# EAGLE design XibecaModuleTop (EAGLE 9.6.2)
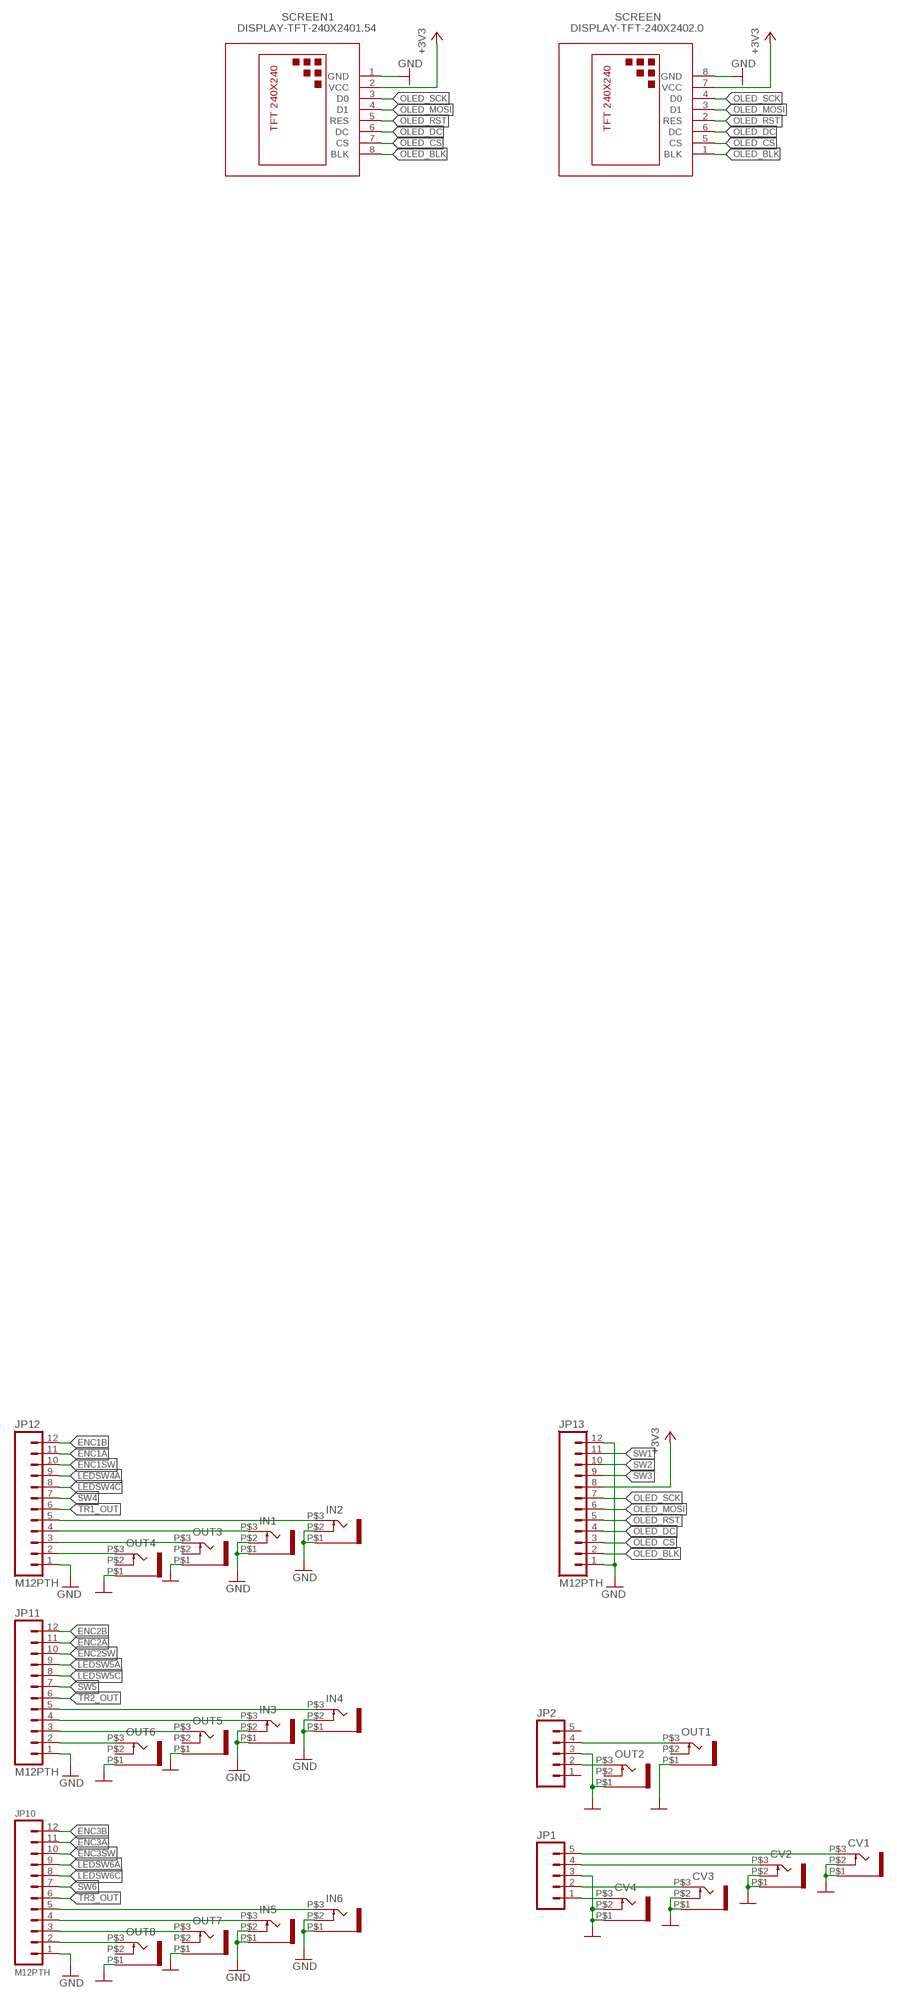
[diagram p0: schematic, sheet 1, part 1 of 2]
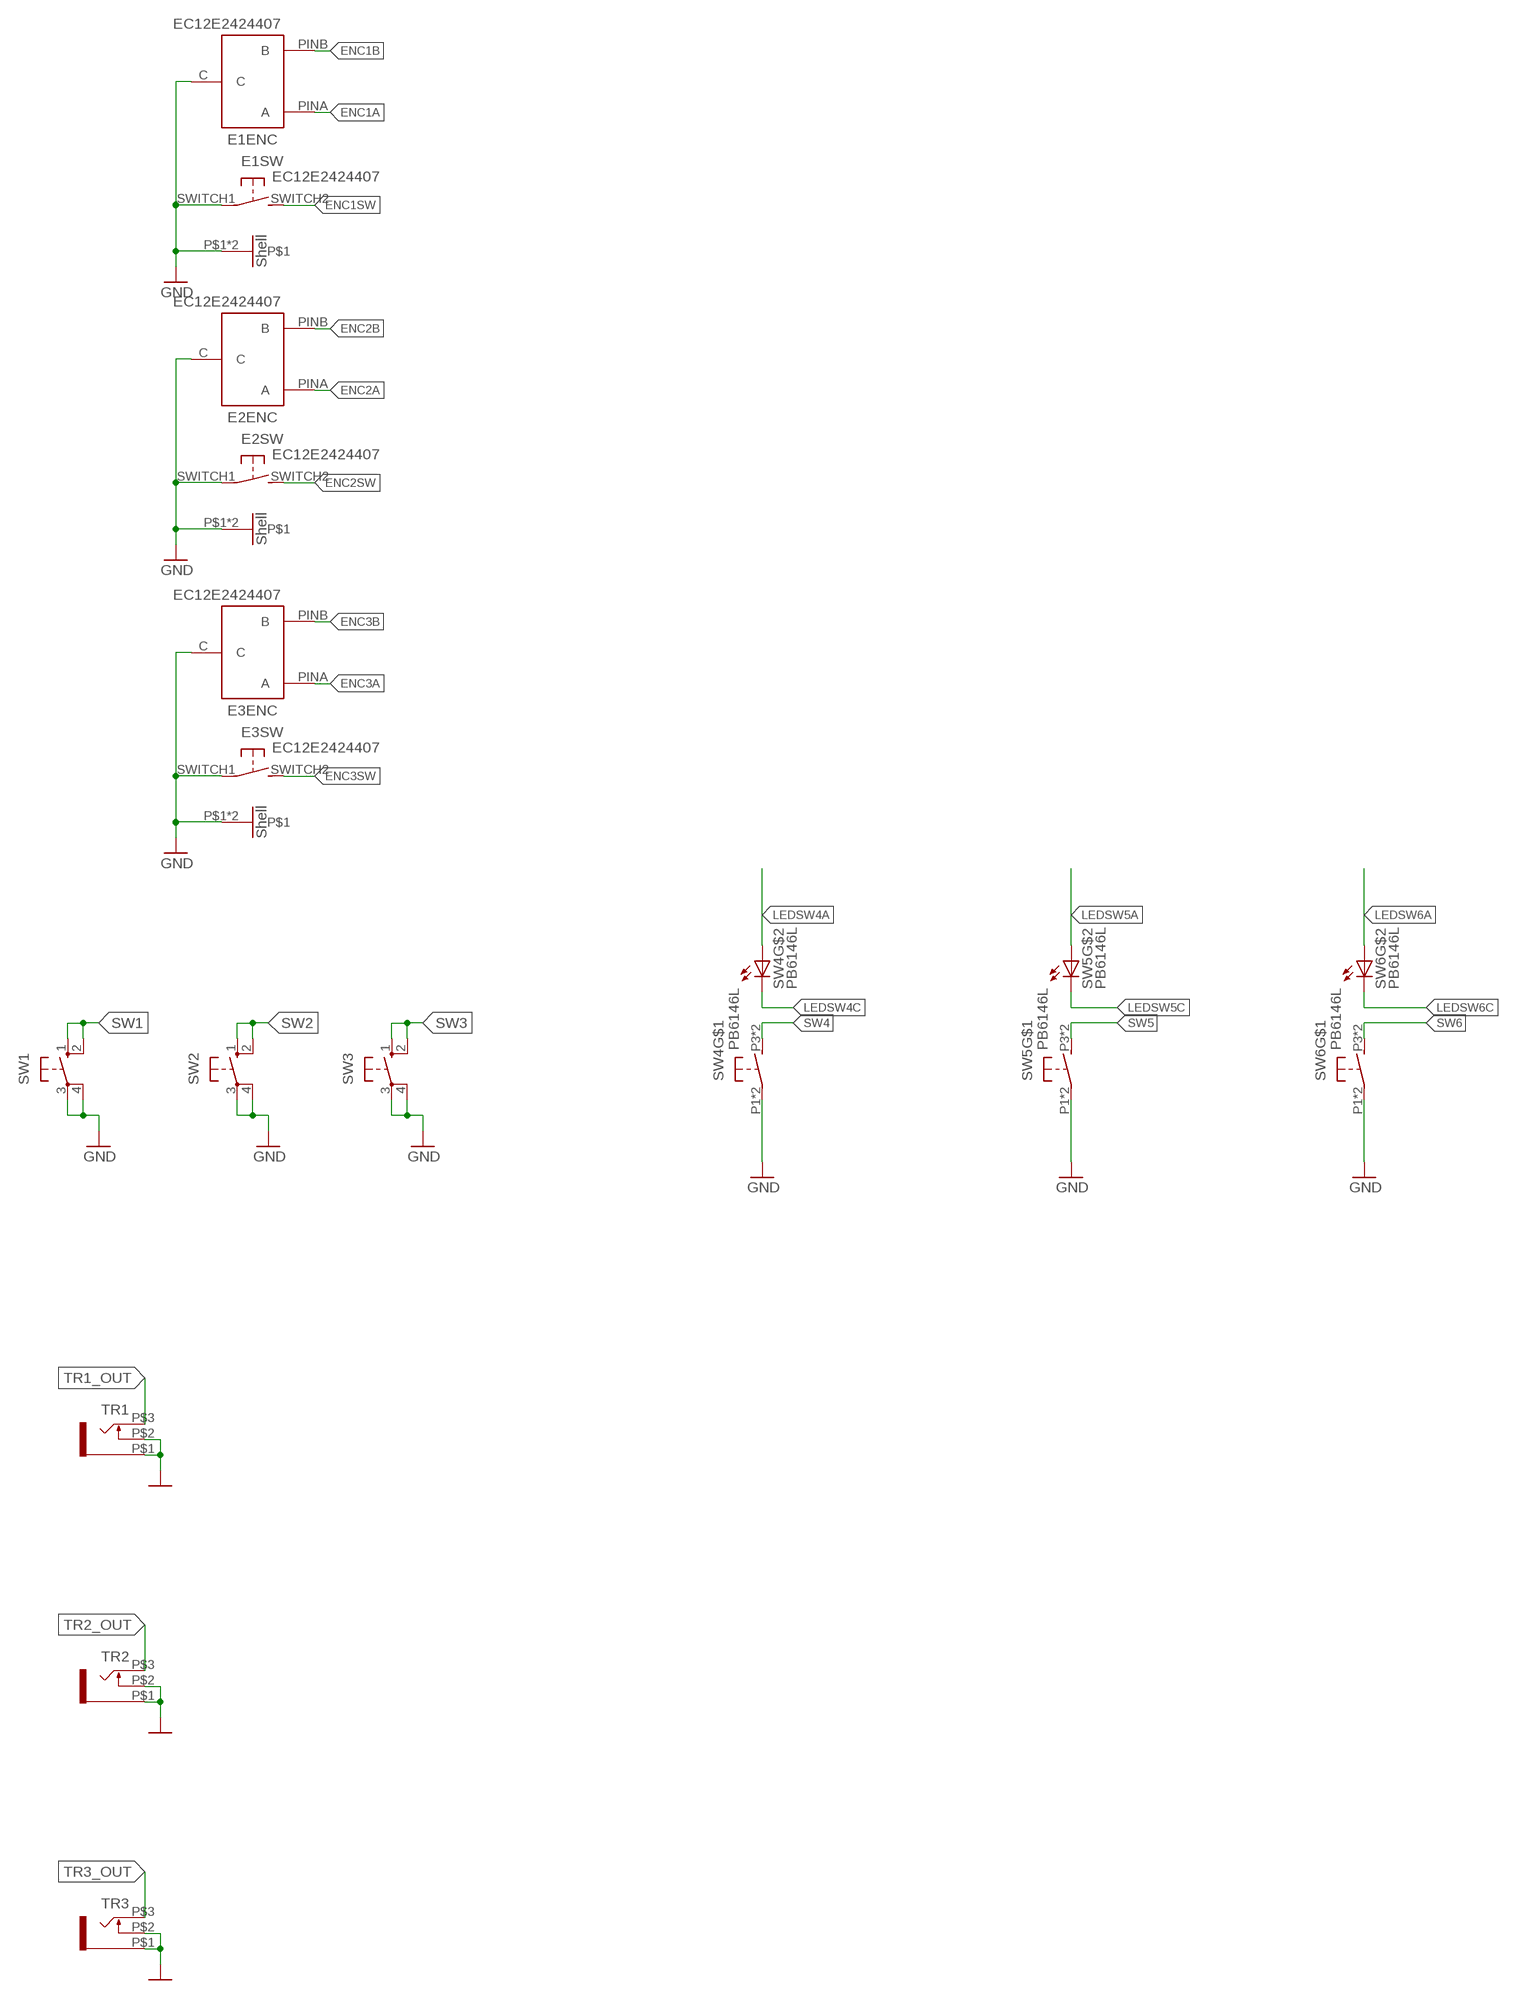
[diagram p1: schematic, sheet 1, part 2 of 2]

## Parts
CV1  THONKICONN  [THONKICONN]
CV2  THONKICONN  [THONKICONN]
CV3  THONKICONN  [THONKICONN]
CV4  THONKICONN  [THONKICONN]
E1  EC12E2424407  [EC12E2424407]
E2  EC12E2424407  [EC12E2424407]
E3  EC12E2424407  [EC12E2424407]
IN1  THONKICONN  [THONKICONN]
IN2  THONKICONN  [THONKICONN]
IN3  THONKICONN  [THONKICONN]
IN4  THONKICONN  [THONKICONN]
IN5  THONKICONN  [THONKICONN]
IN6  THONKICONN  [THONKICONN]
JP1  M05PTH  [1X05]
JP2  M05PTH  [1X05]
JP10  M12PTH  [1X12]
JP11  M12PTH  [1X12]
JP12  M12PTH  [1X12]
JP13  M12PTH  [1X12]
OUT1  THONKICONN  [THONKICONN]
OUT2  THONKICONN  [THONKICONN]
OUT3  THONKICONN  [THONKICONN]
OUT4  THONKICONN  [THONKICONN]
OUT5  THONKICONN  [THONKICONN]
OUT6  THONKICONN  [THONKICONN]
OUT7  THONKICONN  [THONKICONN]
OUT8  THONKICONN  [THONKICONN]
SCREEN  DISPLAY-TFT-240X2402.0  [DISPLAY-TFT-240X320-2.0"]
SCREEN1  DISPLAY-TFT-240X2401.54  [DISPLAY-TFT-240X240-1.54"]
SW1  10-XX  [B3F-10XX]
SW2  10-XX  [B3F-10XX]
SW3  10-XX  [B3F-10XX]
SW4  PB6146L  [PB6146L]
SW5  PB6146L  [PB6146L]
SW6  PB6146L  [PB6146L]
TR1  THONKICONN  [THONKICONN]
TR2  THONKICONN  [THONKICONN]
TR3  THONKICONN  [THONKICONN]

## Nets
+3V3: JP13.8 SCREEN1.2(VCC) SCREEN.7(VCC)
ENC1A: E1.PINA(ENC:A) JP12.11
ENC1B: E1.PINB(ENC:B) JP12.12
ENC1SW: E1.SWITCH2(SW:S) JP12.10
ENC2A: E2.PINA(ENC:A) JP11.11
ENC2B: E2.PINB(ENC:B) JP11.12
ENC2SW: E2.SWITCH2(SW:S) JP11.10
ENC3A: E3.PINA(ENC:A) JP10.11
ENC3B: E3.PINB(ENC:B) JP10.12
ENC3SW: E3.SWITCH2(SW:S) JP10.10
GND: CV1.P$1 CV1.P$2 CV2.P$1 CV2.P$2 CV3.P$1 CV3.P$2 CV4.P$1 CV4.P$2 E1.C(ENC:C) E1.P$1 E1.P$2 E1.SWITCH1(SW:P) E2.C(ENC:C) E2.P$1 E2.P$2 E2.SWITCH1(SW:P) E3.C(ENC:C) E3.P$1 E3.P$2 E3.SWITCH1(SW:P) IN1.P$1 IN1.P$2 IN2.P$1 IN2.P$2 IN3.P$1 IN3.P$2 IN4.P$1 IN4.P$2 IN5.P$1 IN5.P$2 IN6.P$1 IN6.P$2 JP1.3 JP2.3 JP10.1 JP11.1 JP12.1 JP13.1 JP13.12 OUT1.P$1 OUT2.P$1 OUT3.P$1 OUT4.P$1 OUT5.P$1 OUT6.P$1 OUT7.P$1 OUT8.P$1 SCREEN1.1(GND) SCREEN.8(GND) SW1.3(P) SW1.4(P1) SW2.3(P) SW2.4(P1) SW3.3(P) SW3.4(P1) SW4.P1(P) SW4.P2(P) SW5.P1(P) SW5.P2(P) SW6.P1(P) SW6.P2(P) TR1.P$1 TR1.P$2 TR2.P$1 TR2.P$2 TR3.P$1 TR3.P$2
LEDSW4A: JP12.9 SW4.PL1(A)
LEDSW4C: JP12.8 SW4.PL2(C)
LEDSW5A: JP11.9 SW5.PL1(A)
LEDSW5C: JP11.8 SW5.PL2(C)
LEDSW6A: JP10.9 SW6.PL1(A)
LEDSW6C: JP10.8 SW6.PL2(C)
N$19: IN2.P$3 JP12.5
N$33: IN1.P$3 JP12.4
N$34: JP12.3 OUT3.P$3
N$43: JP12.2 OUT4.P$3
N$46: JP11.2 OUT6.P$3
N$51: JP11.3 OUT5.P$3
N$54: JP2.4 OUT1.P$3
N$55: JP2.2 OUT2.P$3
N$58: IN3.P$3 JP11.4
N$62: IN4.P$3 JP11.5
N$67: JP10.2 OUT8.P$3
N$86: JP10.3 OUT7.P$3
N$87: IN5.P$3 JP10.4
N$88: IN6.P$3 JP10.5
N$89: CV4.P$3 JP1.1
N$90: CV1.P$3 JP1.5
N$91: CV2.P$3 JP1.4
N$92: CV3.P$3 JP1.2
OLED_BLK: JP13.2 SCREEN1.8(BLK) SCREEN.1(BLK)
OLED_CS: JP13.3 SCREEN1.7(CS) SCREEN.5(CS)
OLED_DC: JP13.4 SCREEN1.6(DC) SCREEN.6(DC)
OLED_MOSI: JP13.6 SCREEN1.4(D1) SCREEN.3(D1)
OLED_RST: JP13.5 SCREEN1.5(RES) SCREEN.2(RES)
OLED_SCK: JP13.7 SCREEN1.3(D0) SCREEN.4(D0)
SW1: JP13.11 SW1.1(S) SW1.2(S1)
SW2: JP13.10 SW2.1(S) SW2.2(S1)
SW3: JP13.9 SW3.1(S) SW3.2(S1)
SW4: JP12.7 SW4.P3(S) SW4.P4(S)
SW5: JP11.7 SW5.P3(S) SW5.P4(S)
SW6: JP10.7 SW6.P3(S) SW6.P4(S)
TR1_OUT: JP12.6 TR1.P$3
TR2_OUT: JP11.6 TR2.P$3
TR3_OUT: JP10.6 TR3.P$3
Unconnected: JP2.1 JP2.5 OUT1.P$2 OUT2.P$2 OUT3.P$2 OUT4.P$2 OUT5.P$2 OUT6.P$2 OUT7.P$2 OUT8.P$2

## Library data of the parts
CV1-CV4 IN1-IN6 OUT1-OUT8 TR1-TR3 = Rebel:THONKICONN
E1-E3 = Rebel:EC12E2424407: rotary encoder with switch EC12E2424407
JP1 JP2 = SparkFun:M05: Header 5 Standard 5-pin 0.1" header. Use with straight break away headers (SKU : PRT-00116), right angle break away headers (PRT-00553), swiss pins (PRT-00743), machine pins (PRT-00117), and female headers (PRT-00115). Molex polarized connector foot print use with SKU : PRT-08230 with associated crimp pins and housings.
JP10-JP13 = SparkFun:M12: Header 12 Standard 12-pin 0.1" header. Use with straight break away headers (SKU : PRT-00116), right angle break away headers (PRT-00553), swiss pins (PRT-00743), machine pins (PRT-00117), and female headers (PRT-00115).
SCREEN SCREEN1 = diy-modules:DISPLAY-TFT-240X240: 240X240 TFT Screen Module with ST7789 driver chip Variant with SPI interface
SW1-SW3 = switch-omron:10-XX: OMRON SWITCH; MPN: B3F-1000; OC_FARNELL: 176432; OC_NEWARK: 36M3542
SW4-SW6 = Rebel:PB6146L

## Net classes
1 power: width 0.178 mm, drill 0.305 mm, clearance 0.178 mm to class 0, clearance 0.178 mm

## Board
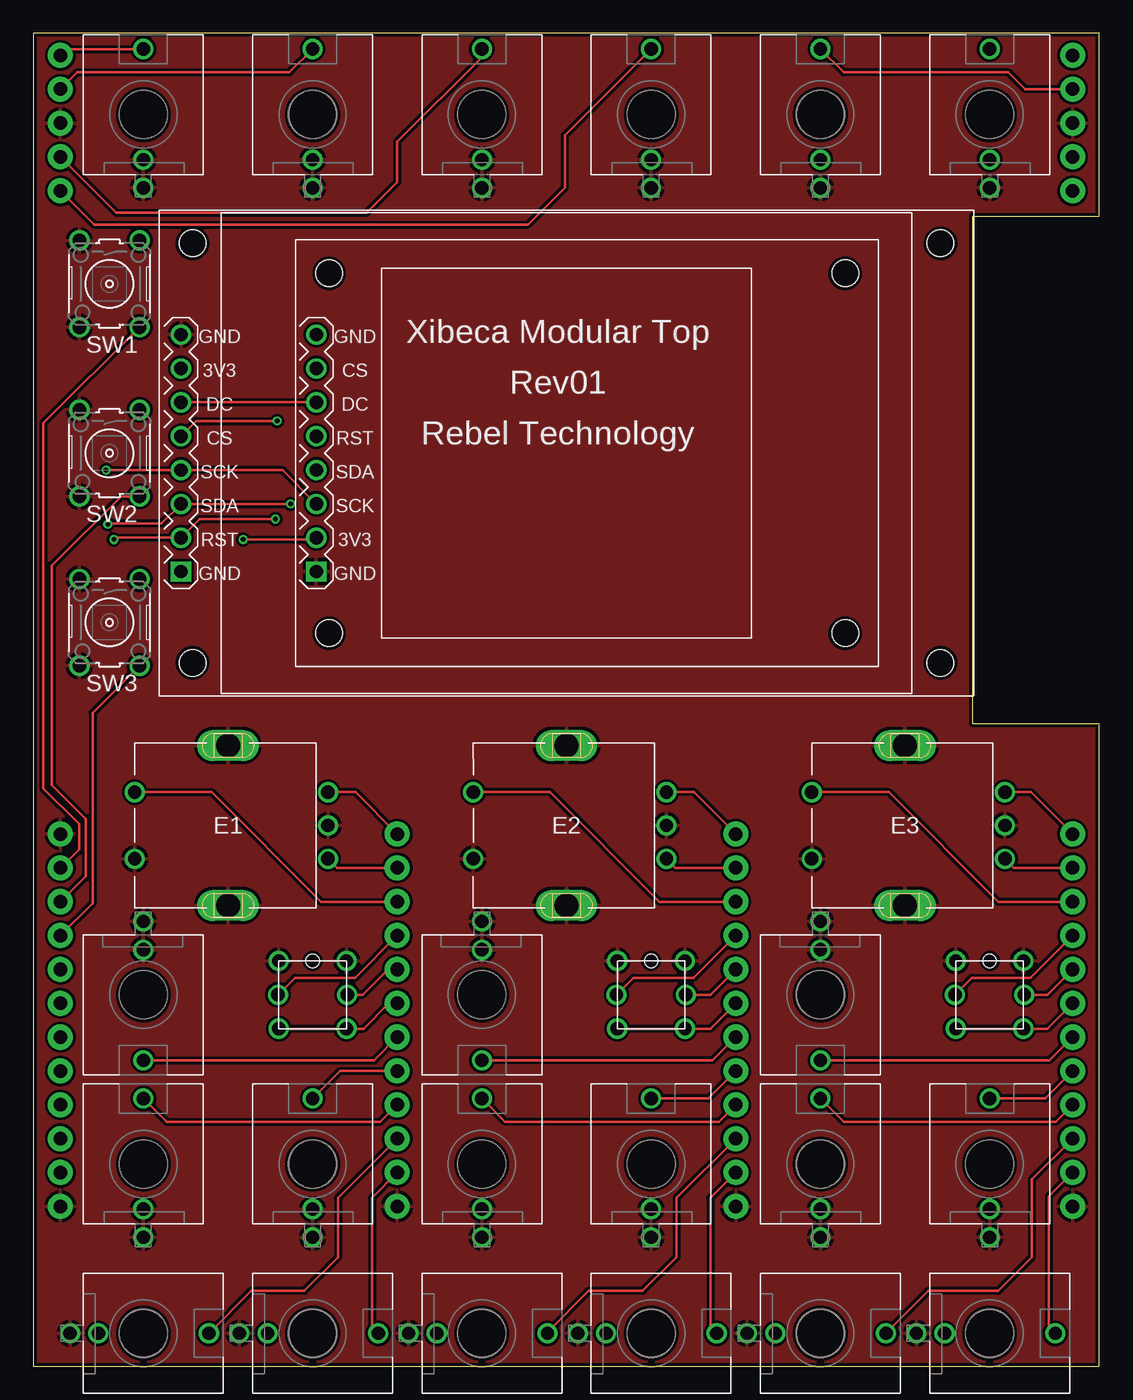
[diagram p2: board, top side]
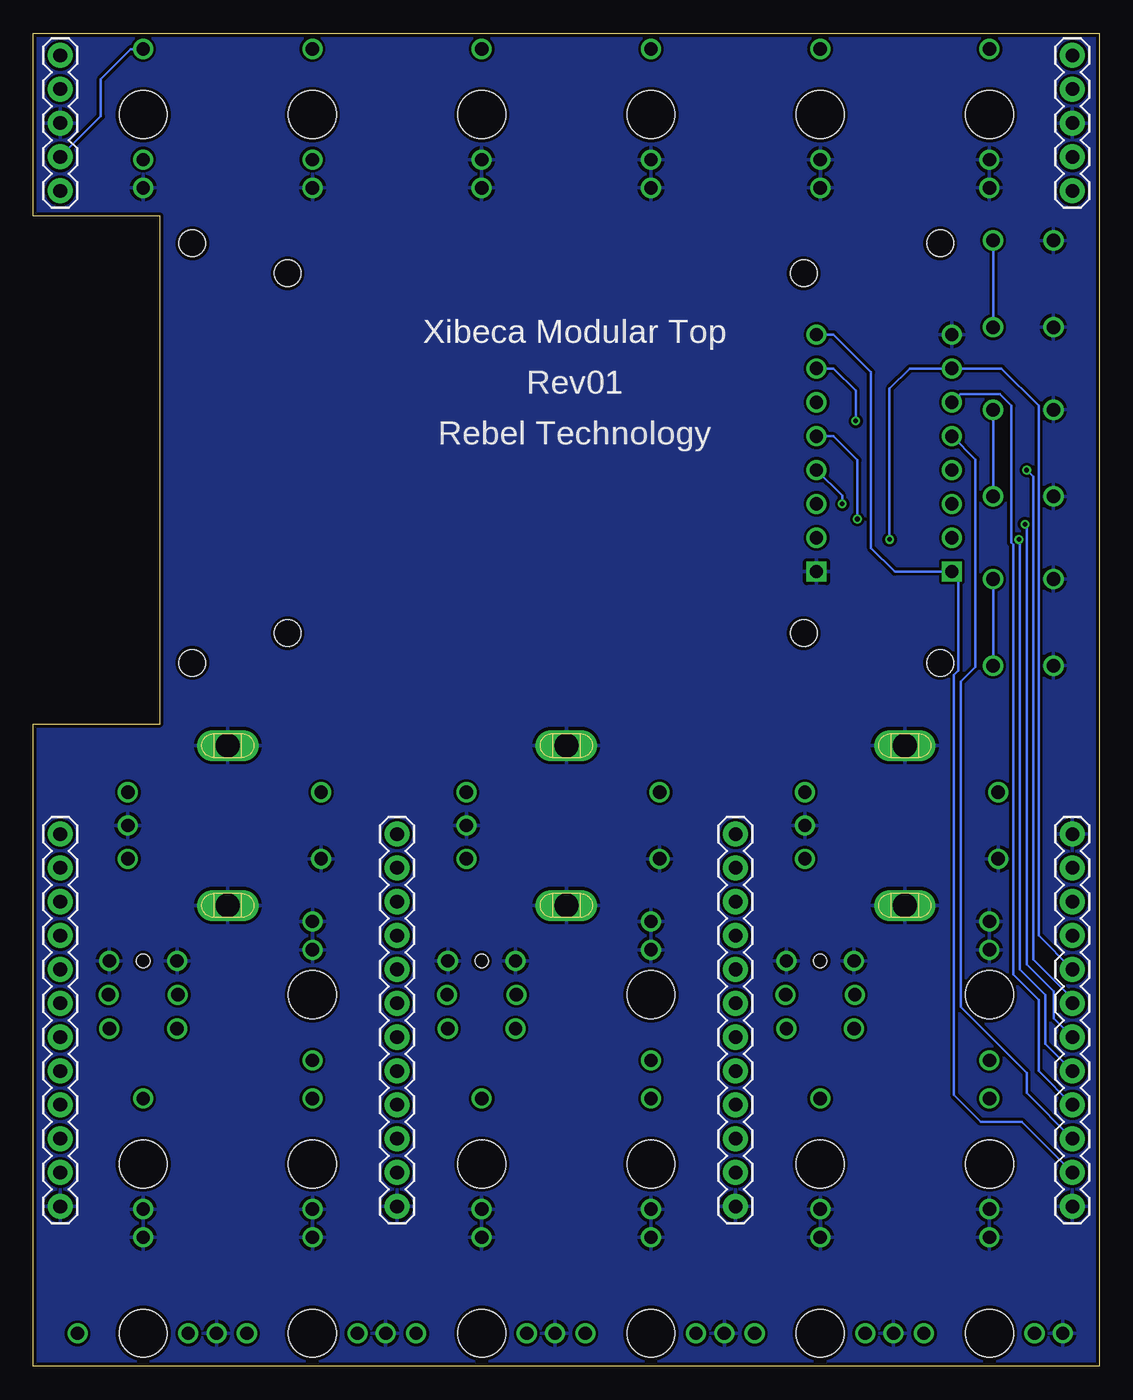
[diagram p3: board, bottom side, seen from below]

Size 80 x 100 mm. Coordinates in mm from the lower left corner, seen from the top.
Outline: 80,86.28 80,100 0,100 0,0 80,0 80,48.18 70.48,48.18 70.48,86.28 80,86.28
Copper layers (1*16): Top 0.035mm / dielectric 1.5mm / Bottom 0.035mm
Design rules "Fusion_eagle_rule_v1.1": minimum track width 6mil, minimum drill 12mil, track to track 6mil, track to pad 6mil, pad to pad 6mil, via to via 6mil, smd to smd 0mil, copper to edge 10mil, drill to drill 10mil, minimum pad ring 10mil, minimum via ring 6mil, stop-mask expansion 2mil, vias tented up to drill 100mil, thermal gap 10mil

### Footprints (pad centres in the part's own frame; a part is rotated, then mirrored left to right if it is on the bottom)
THONKICONN = drill 1: P$1 0,-5.5; P$2 0,-3.38; P$3 0,4.92 | hole 3.6: 0,0
EC12E2424407 = drill 1: C 0,-7.5; PINA -2.5,-7.5; PINB 2.5,-7.5; SWITCH1 -2.5,7; SWITCH2 2.5,7 | drill 1.8 long: P$1 -6,0; P$2 6,0
1X05 = drill 1.016 pad 1.88: 1 0,0; 2 2.54,0; 3 5.08,0; 4 7.62,0; 5 10.16,0
1X12 = drill 1.016 pad 1.88: 1 0,0; 2 2.54,0; 3 5.08,0; 4 7.62,0; 5 10.16,0; 6 12.7,0; 7 15.24,0; 8 17.78,0; 9 20.32,0; 10 22.86,0; 11 25.4,0; 12 27.94,0
DISPLAY-TFT-240X320-2.0" = drill 1 square: 1 -8.89,28.93 | drill 1: 2 -6.35,28.93; 3 -3.81,28.93; 4 -1.27,28.93; 5 1.27,28.93; 6 3.81,28.93; 7 6.35,28.93; 8 8.89,28.93 | hole 2: -15.74,28.06; 15.74,28.06; 15.74,-28.06; -15.74,-28.06
DISPLAY-TFT-240X240-1.54" = drill 1 square: 1 -8.89,18.77 | drill 1: 2 -6.35,18.77; 3 -3.81,18.77; 4 -1.27,18.77; 5 1.27,18.77; 6 3.81,18.77; 7 6.35,18.77; 8 8.89,18.77 | hole 2: -13.5,17.81; 13.5,17.81; 13.5,-20.91; -13.5,-20.91
B3F-10XX = drill 1.016: 1 -3.251,2.261; 2 3.251,2.261; 3 -3.251,-2.261; 4 3.251,-2.261
PB6146L = drill 1: P1 -2.54,2.54; P2 2.54,2.54; P3 -2.54,-2.54; P4 2.54,-2.54; PL1 -2.6,0; PL2 2.6,0 | hole 1: 0,2.54

### Placement (x,y rotation side)
CV1  8.26,93.9 0 top
CV2  20.95,93.9 0 top
CV3  33.66,93.9 0 top
CV4  46.35,93.9 0 top
E1  14.61,40.56 90 top
E2  40.01,40.56 90 top
E3  65.41,40.56 90 top
IN1  8.26,15.16 0 top
IN2  20.95,15.16 0 top
IN3  33.66,15.16 0 top
IN4  46.35,15.16 0 top
IN5  59.05,15.16 0 top
IN6  71.75,15.16 0 top
JP1  2.03,88.19 90 bottom
JP2  77.98,88.19 90 bottom
JP10  77.98,11.99 90 bottom
JP11  52.7,11.99 90 bottom
JP12  27.3,11.99 90 bottom
JP13  2.03,11.99 90 bottom
OUT1  59.05,93.9 0 top
OUT2  71.75,93.9 0 top
OUT3  8.26,2.46 270 top
OUT4  20.95,2.46 270 top
OUT5  33.66,2.46 270 top
OUT6  46.35,2.46 270 top
OUT7  59.05,2.46 270 top
OUT8  71.75,2.46 270 top
SCREEN  40.01,68.5 90 top
SCREEN1  40.01,68.5 90 top
SW1  5.71,81.2 270 top
SW2  5.71,68.5 270 top
SW3  5.71,55.8 270 top
SW4  20.95,27.86 0 top
SW5  46.35,27.86 0 top
SW6  71.75,27.86 0 top
TR1  8.26,27.86 180 top
TR2  33.66,27.86 180 top
TR3  59.05,27.86 180 top

### Tracks (layer width: path | path; a pad name or v marks a point on that pad's centre or on a via)
+3V3  (via drill 0.35)
  Top 0.203: v15.75,62.03 21.11,62.03 SCREEN1.2
  Bottom 0.203: JP13.8 4.57,32.31 4.57,72.06 7.37,74.85 SCREEN.7 14.22,74.85 15.75,73.33 v15.75,62.03
ENC1A
  Top 0.203: JP12.11 22.78,37.39 E1.PINA
ENC1B
  Top 0.203: JP12.12 24.17,43.06 E1.PINB
ENC1SW
  Top 0.203: E1.SWITCH2 13.38,43.06 21.59,34.85 JP12.10
ENC2A
  Top 0.203: JP11.11 48.18,37.39 E2.PINA
ENC2B
  Top 0.203: JP11.12 49.57,43.06 E2.PINB
ENC2SW
  Top 0.203: JP11.10 46.99,34.85 38.77,43.06 E2.SWITCH2
ENC3A
  Top 0.203: JP10.11 73.58,37.39 E3.PINA
ENC3B
  Top 0.203: E3.PINB 74.84,43.06 JP10.12
ENC3SW
  Top 0.203: JP10.10 72.39,34.85 64.17,43.06 E3.SWITCH2
GND
  pour Top (isolate 0.2): -2.24,116.76 85.65,116.76 85.65,-10.24 -2.24,-10.24
  pour Bottom (isolate 0.2): -7.92,111.68 83.34,111.68 83.34,-15.32 -7.92,-15.32
LEDSW4A
  Top 0.203: SW4.PL1 19.62,29.13 24.13,29.13 JP12.9
LEDSW4C
  Top 0.203: SW4.PL2 24.7,27.86 26.6,29.77 JP12.8
LEDSW5A
  Top 0.203: SW5.PL1 45.02,29.13 49.53,29.13 JP11.9
LEDSW5C
  Top 0.203: JP11.8 50.8,27.86 SW5.PL2
LEDSW6A
  Top 0.203: SW6.PL1 70.42,29.13 74.8,29.13 JP10.9
LEDSW6C
  Top 0.203: JP10.8 76.07,27.86 SW6.PL2
N$19
  Top 0.203: IN2.P$3 23.02,22.15 JP12.5
N$33
  Top 0.203: IN1.P$3 10,18.34 26.04,18.34 JP12.4
N$34
  Top 0.203: JP12.3 22.86,12.62 22.86,8.18 20.32,5.64 16.35,5.64 OUT3.P$3
N$43
  Top 0.203: JP12.2 25.4,12.62 25.4,2.94 OUT4.P$3
N$46
  Top 0.203: JP11.2 50.8,12.62 50.8,2.94 OUT6.P$3
N$51
  Top 0.203: JP11.3 48.26,12.62 48.26,8.18 45.72,5.64 41.66,5.64 38.58,2.56 OUT5.P$3
N$54
  Top 0.203: JP2.4 74.42,95.81 73.15,97.08 60.8,97.08 OUT1.P$3
N$55
  Bottom 0.203: JP2.2 74.93,93.78 74.93,96.57 72.68,98.82 OUT2.P$3
N$58
  Top 0.203: JP11.4 51.44,18.34 35.4,18.34 IN3.P$3
N$62
  Top 0.203: JP11.5 50.64,20.08 IN4.P$3
N$67
  Top 0.203: JP10.2 76.2,12.75 76.2,2.94 OUT8.P$3
N$86
  Top 0.203: JP10.3 74.93,14.02 74.93,8.18 72.39,5.64 67.15,5.64 OUT7.P$3
N$87
  Top 0.203: JP10.4 76.71,18.34 60.8,18.34 IN5.P$3
N$88
  Top 0.203: JP10.5 75.91,20.08 IN6.P$3
N$89
  Top 0.203: JP1.1 4.57,85.65 37.12,85.65 39.88,88.41 39.88,92.35 CV4.P$3
N$90
  Top 0.203: JP1.5 2.51,98.82 CV1.P$3
N$91
  Top 0.203: CV2.P$3 19.21,97.08 3.3,97.08 JP1.4
N$92
  Top 0.203: JP1.2 6.22,86.54 25.02,86.54 27.31,88.83 27.31,91.88 33.66,98.22 CV3.P$3
OLED_BLK
  Bottom 0.203: JP13.2 5.84,18.34 8.89,18.34 10.92,20.37 10.92,51.87 10.59,52.2 10.59,59.17 11.04,59.61 SCREEN.1 15.37,59.61 17.14,61.39 17.14,74.57 19.96,77.39 SCREEN1.8
OLED_CS  (via drill 0.35)
  Top 0.203: SCREEN.5 12.22,70.92 v18.29,70.92
  Bottom 0.203: JP13.3 5.46,20.5 5.46,22.02 10.41,26.97 10.41,51.36 9.3,52.47 9.3,68.03 11.05,69.77 SCREEN.5 | v18.29,70.92 18.29,73.18 19.96,74.85 SCREEN1.7
OLED_DC
  Top 0.203: SCREEN.6 SCREEN1.6
  Bottom 0.203: JP13.4 4.57,22.15 4.57,27.48 6.48,29.39 6.48,61.64 6.63,61.79 6.63,62.27 6.6,62.29 6.6,72.06 7.49,72.95 10.44,72.95 SCREEN.6
OLED_MOSI  (via drill 0.35)
  Top 0.203: v5.59,63.17 5.64,63.22 9.6,63.22 SCREEN.3 v19.3,64.69
  Bottom 0.203: JP13.6 3.43,26.09 3.43,28.12 5.46,30.15 5.46,63.05 v5.59,63.17 | v19.3,64.69 19.3,65.3 SCREEN1.4
OLED_RST  (via drill 0.35)
  Top 0.203: v6.05,62.03 6.17,62.15 SCREEN.2 12.47,63.55 v18.16,63.55
  Bottom 0.203: JP13.5 4.06,24.18 4.06,27.86 5.97,29.77 5.97,61.95 v6.05,62.03 | v18.16,63.55 18.16,67.97 19.96,69.77 SCREEN1.5
OLED_SCK  (via drill 0.35)
  Top 0.203: v5.46,67.23 SCREEN.4 18.7,67.23 SCREEN1.3
  Bottom 0.203: JP13.7 2.03,27.61 4.95,30.53 4.95,66.73 v5.46,67.23
SW1
  Top 0.203: SW1.2 0.76,70.74 0.76,43.36 3.43,40.69 3.43,38.79 JP13.11
  Bottom 0.203: SW1.1 SW1.2
SW2
  Top 0.203: SW2.2 6.58,65.25 1.4,60.07 1.4,43.61 3.94,41.07 3.94,36.75 JP13.10
  Bottom 0.203: SW2.1 SW2.2
SW3
  Top 0.203: SW3.2 4.45,49.02 4.45,34.72 JP13.9
  Bottom 0.203: SW3.1 SW3.2
SW4
  Top 0.203: JP12.7 26.67,27.23 24.77,25.32 SW4.P4 SW4.P3
SW5
  Top 0.203: JP11.7 50.8,25.32 SW5.P4 SW5.P3
SW6
  Top 0.203: JP10.7 76.07,25.32 SW6.P4 SW6.P3
TR1_OUT
  Top 0.203: TR1.P$3 25.56,22.94 JP12.6
TR2_OUT
  Top 0.203: JP11.6 50.96,22.94 TR2.P$3
TR3_OUT
  Top 0.203: JP10.6 76.23,22.94 TR3.P$3

### Text on the board
tPlace: GND | GND | Xibeca Modular Top | 3V3 | CS | Rev01 | DC | DC | CS | RST | Rebel Technology | SCK | SDA | SDA | SCK | RST | 3V3 | GND | GND
bPlace: Xibeca Modular Top | Rev01 | Rebel Technology